# EAGLE design DriverModuleWing (EAGLE 9.6.2)
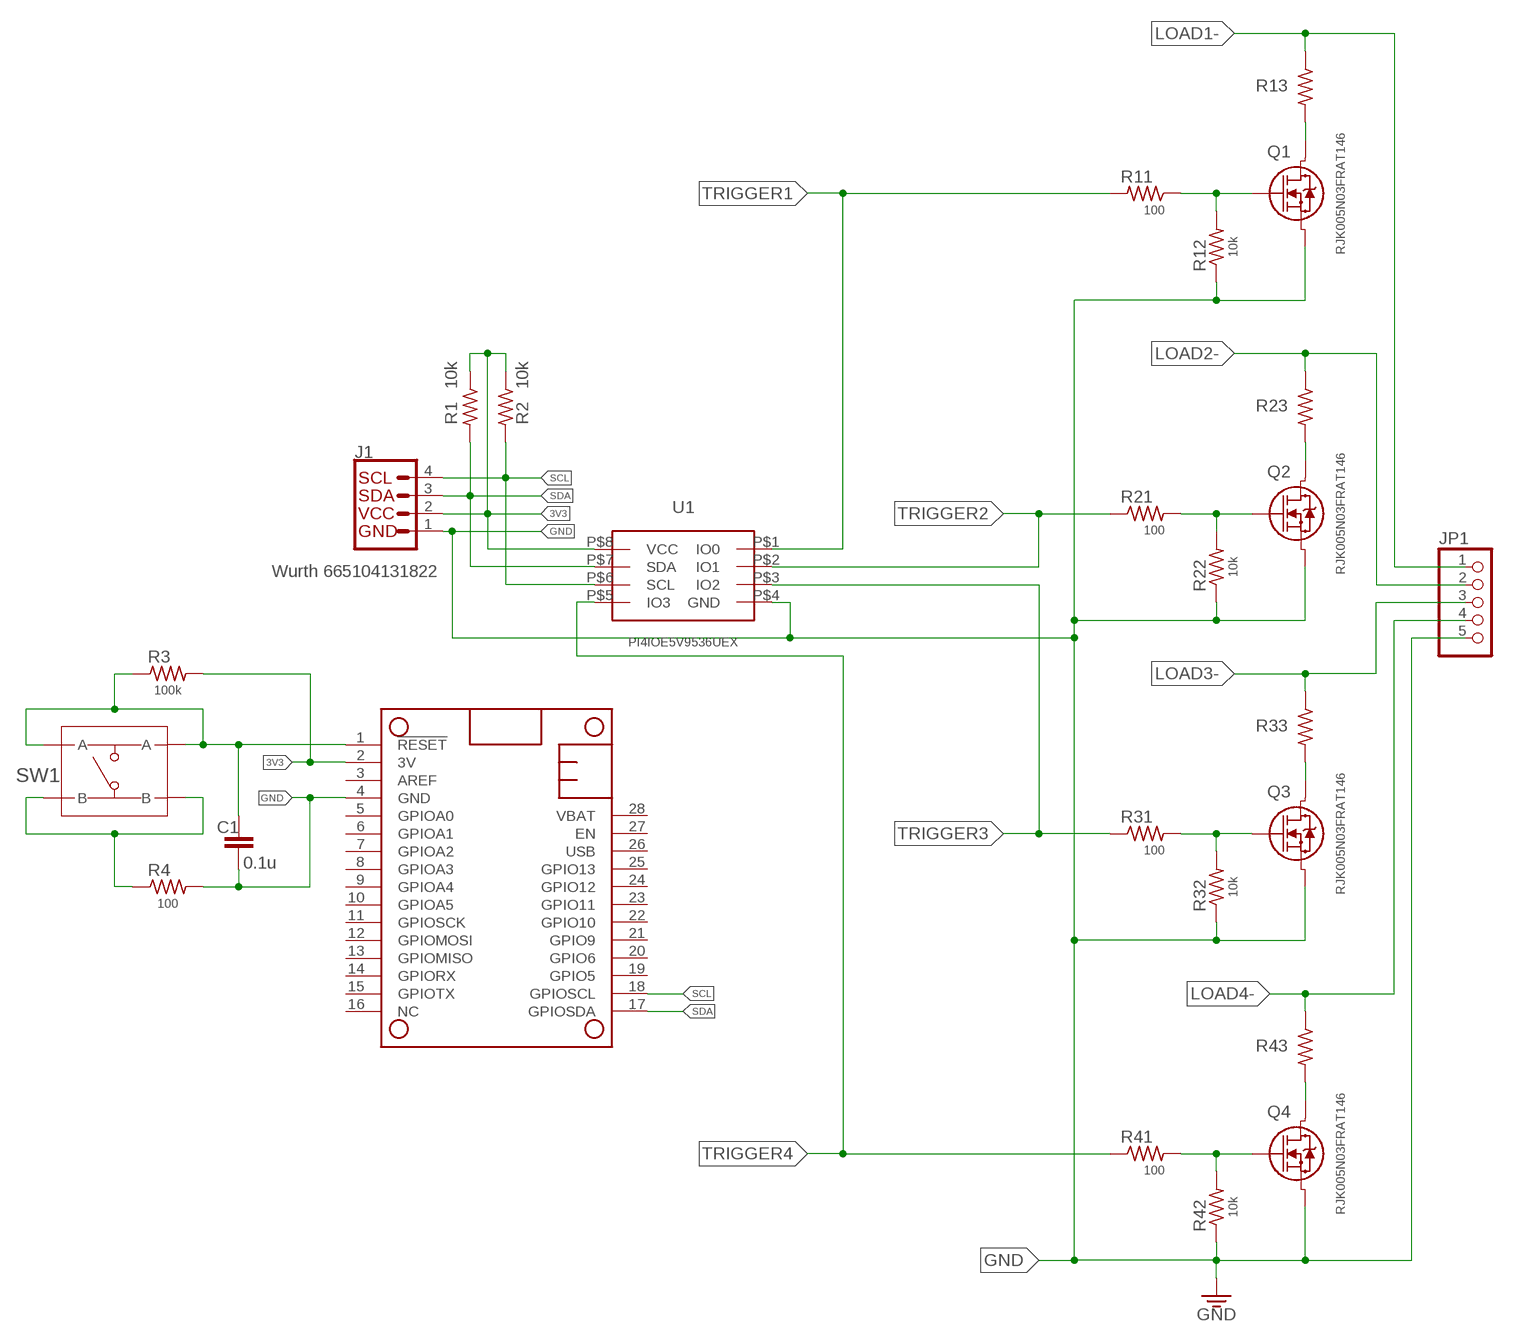
[diagram p0: schematic, sheet 1]

## Parts
C1  0.1u  C-SMD-0805  [SMD-0805]
J1  Wurth 665104131822  QWIIC_CONNECTORJS-1MM  [1X04_1MM_RA]
JP1  HEADER-1X576MIL  [1X05_ROUND_76]
MS1  FEATHERWING_NODIM  [FEATHERWING_DIM]
Q1  RJK005N03FRAT146  RJK005N03FRAT146TRANS_RHK003N_ROM-M  [TRANS_RHK003N_ROM-M]
Q2  RJK005N03FRAT146  RJK005N03FRAT146TRANS_RHK003N_ROM-M  [TRANS_RHK003N_ROM-M]
Q3  RJK005N03FRAT146  RJK005N03FRAT146TRANS_RHK003N_ROM-M  [TRANS_RHK003N_ROM-M]
Q4  RJK005N03FRAT146  RJK005N03FRAT146TRANS_RHK003N_ROM-M  [TRANS_RHK003N_ROM-M]
R1  10k  R-US_R0603  [R0603]
R2  10k  R-US_R0603  [R0603]
R3  100k  R-US_R0603  [R0603]
R4  100  R-US_R0603  [R0603]
R11  100  R-US_R0603  [R0603]
R12  10k  R-US_R0603  [R0603]
R13  R-US_R1206  [R1206]
R21  100  R-US_R0603  [R0603]
R22  10k  R-US_R0603  [R0603]
R23  R-US_R1206  [R1206]
R31  100  R-US_R0603  [R0603]
R32  10k  R-US_R0603  [R0603]
R33  R-US_R1206  [R1206]
R41  100  R-US_R0603  [R0603]
R42  10k  R-US_R0603  [R0603]
R43  R-US_R1206  [R1206]
SW1  PTS645SK43SMTR92LFS-PTS647-4.5  [SWITCH_CK_PTS647SN38SMTR2LFS]
U1  PI4IOE5V9536UEX  PI4IOE5V9536-UEX  [MSOP-8]

## Nets
3V3: J1.2(VCC) MS1.2(3V) R1.1 R2.1 R3.2 U1.P$8(VCC)
GATE1 [8mil]: Q1.2 R11.1 R12.2
GATE2 [8mil]: Q2.2 R21.2 R22.2
GATE3 [8mil]: Q3.2 R31.2 R32.2
GATE4 [8mil]: Q4.2 R41.2 R42.2
GND [8mil]: C1.P$2 J1.1(GND) JP1.5 MS1.4(GND) Q1.3 Q2.3 Q3.3 Q4.3 R4.2 R12.1 R22.1 R32.1 R42.1 U1.P$4(GND)
LD- [8mil]: Q4.1 R43.2
LD-1 [8mil]: Q3.1 R33.2
LD-2 [8mil]: Q2.1 R23.2
LD-3 [8mil]: Q1.1 R13.2
LOAD1- [8mil]: JP1.1 R13.1
LOAD2- [8mil]: JP1.2 R23.1
LOAD3- [8mil]: JP1.3 R33.1
LOAD4- [8mil]: JP1.4 R43.1
N$1: C1.P$1 MS1.1(!RESET) R3.1 SW1.1(A) SW1.2(A)
N$2: R4.1 SW1.3(B) SW1.4(B)
SCL: J1.4(SCL) MS1.18(GPIOSCL) R2.2 U1.P$6(SCL)
SDA: J1.3(SDA) MS1.17(GPIOSDA) R1.2 U1.P$7(SDA)
TRIGGER1 [8mil]: R11.2 U1.P$1(IO0)
TRIGGER2 [8mil]: R21.1 U1.P$2(IO1)
TRIGGER3 [8mil]: R31.1 U1.P$3(IO2)
TRIGGER4 [8mil]: R41.1 U1.P$5(IO3)
Unconnected: MS1.3(AREF) MS1.5(GPIOA0) MS1.6(GPIOA1) MS1.7(GPIOA2) MS1.8(GPIOA3) MS1.9(GPIOA4) MS1.10(GPIOA5) MS1.11(GPIOSCK) MS1.12(GPIOMOSI) MS1.13(GPIOMISO) MS1.14(GPIORX) MS1.15(GPIOTX) MS1.16(NC) MS1.19(GPIO5) MS1.20(GPIO6) MS1.21(GPIO9) MS1.22(GPIO10) MS1.23(GPIO11) MS1.24(GPIO12) MS1.25(GPIO13) MS1.26(USB) MS1.27(EN) MS1.28(VBAT)

## Library data of the parts
C1 = home:C-SMD: CAPACITOR naming: grid - package width
J1 = SparkFun-Connectors:QWIIC_CONNECTOR: SparkFun I2C Standard Qwiic Connector An SMD 1mm pitch JST connector makes it easy and quick (get it? Qwiic?) to connect I2C devices to each other. The Qwiic system <http://www.sparkfun.com/qwiic> enables fast and solderless connection between popular platforms and various sensors and actuators. We carry 200mm <https://www.sparkfun.com/products/14204>, 100mm <https://www.sparkfun.com/products/14205>, 50mm <https://www.sparkfun.com/products/14206>, and breadboard friendly <https://www.sparkfun.com/products/14207> Qwiic cables. We also offer 10 pcs strips <https://www.sparkfun.com/products/14323> the SMD connectors.
JP1 = microbuilder:HEADER-1X5: PIN HEADER
MS1 = adafruit:FEATHERWING
Q1-Q4 = home:RJK005N03FRAT146; COPYRIGHT: Copyright (C) 2022 Ultra Librarian. All rights reserved.; DIGI-KEY_PART_NUMBER_1: RJK005N03FRAT146CT-ND; DIGI-KEY_PART_NUMBER_2: RJK005N03FRAT146DKR-ND; DIGI-KEY_PART_NUMBER_3: RJK005N03FRAT146TR-ND; MANUFACTURER_PART_NUMBER: RJK005N03FRAT146; MFR_NAME: ROHM Semiconductor
R1-R4 R11-R13 R21-R23 R31-R33 R41-R43 = adafruit:R-US_: RESISTOR, American symbol
SW1 = home:PTS645SK43SMTR92LFS
U1 = home:PI4IOE5V9536

## Net classes
1 8mil: width 0.203 mm

## Board
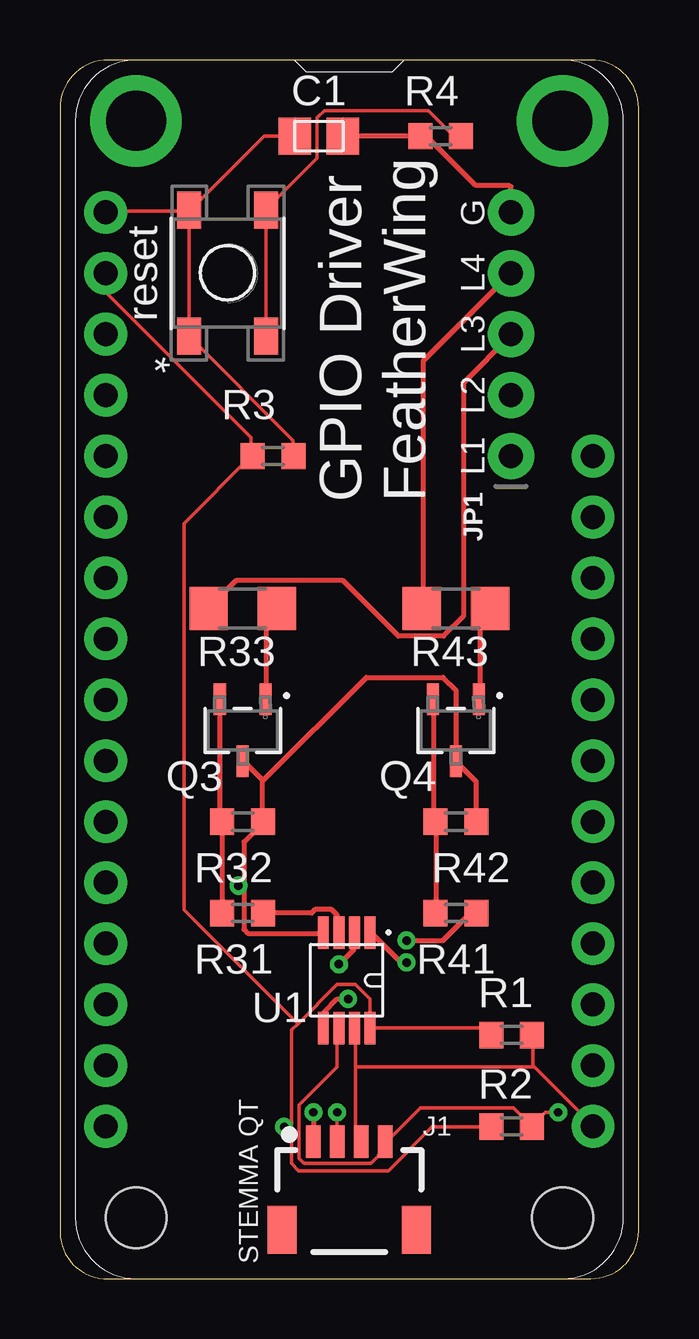
[diagram p1: board, top side]
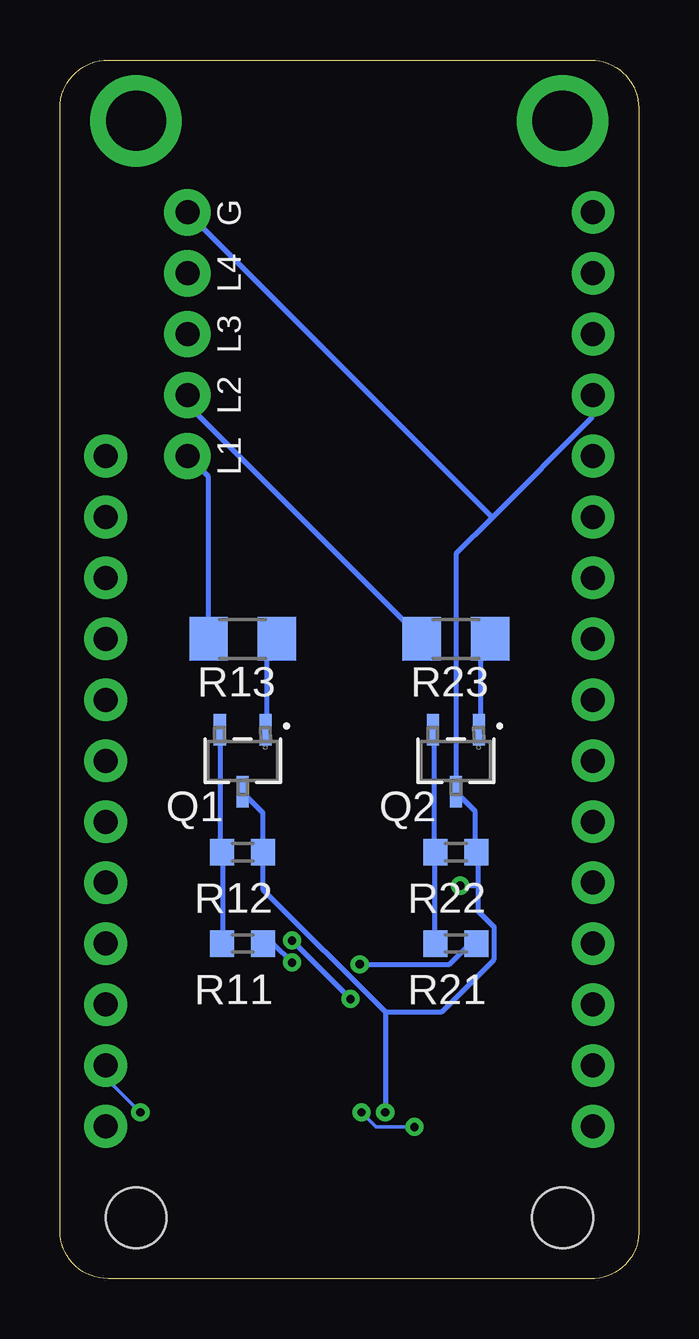
[diagram p2: board, bottom side, seen from below]

Size 24.13 x 50.8 mm. Coordinates in mm from the lower left corner, seen from the top.
Outline: 24.13,2 24.13,48.8 arc90 22.13,50.8 2,50.8 arc90 0,48.8 0,1.91 arc90 2,0 22.13,0 arc90 24.13,2
Copper layers (1*16): Top 0.035mm / dielectric 1.5mm / Bottom 0.035mm
Design rules "default": minimum track width 6mil, minimum drill 0.35mm, track to track 6mil, track to pad 6mil, pad to pad 6mil, via to via 6mil, smd to smd 6mil, copper to edge 40mil, drill to drill 6mil, minimum pad ring 10mil, minimum via ring 8mil, stop-mask expansion 4mil, vias tented up to drill 0mil, thermal gap 10mil

### Footprints (pad centres in the part's own frame; a part is rotated, then mirrored left to right if it is on the bottom)
SMD-0805 = smd 1.35 x 1.55: P$1 -1,0; P$2 1,0
1X04_1MM_RA = smd 0.6 x 1.35: 1 -1.5,0; 2 -0.5,0; 3 0.5,0; 4 1.5,0 | smd 1.2 x 2: NC1 2.8,-3.675; NC2 -2.8,-3.675
1X05_ROUND_76 = drill 1 pad 1.93: 1 -5.08,0; 2 -2.54,0; 3 0,0; 4 2.54,0; 5 5.08,0
FEATHERWING_DIM = drill 1 pad 1.778: 1 6.35,1.27; 2 8.89,1.27; 3 11.43,1.27; 4 13.97,1.27; 5 16.51,1.27; 6 19.05,1.27; 7 21.59,1.27; 8 24.13,1.27; 9 26.67,1.27; 10 29.21,1.27; 11 31.75,1.27; 12 34.29,1.27; 13 36.83,1.27; 14 39.37,1.27; 15 41.91,1.27; 16 44.45,1.27; 17 44.45,21.59; 18 41.91,21.59; 19 39.37,21.59; 20 36.83,21.59; 21 34.29,21.59; 22 31.75,21.59; 23 29.21,21.59; 24 26.67,21.59; 25 24.13,21.59; 26 21.59,21.59; 27 19.05,21.59; 28 16.51,21.59 | drill 2.5 pad 3.81: P$1 2.54,20.32; P$2 2.54,2.54 | hole 2.54: 48.26,20.32; 48.26,2.54
TRANS_RHK003N_ROM-M = smd 0.508 x 1.321: 1 -0.953,-1.295; 2 0.953,-1.295; 3 0,1.295
R0603 = smd 1 x 1.1: 1 -0.85,0; 2 0.85,0
R1206 = smd 1.6 x 1.803: 1 -1.422,0; 2 1.422,0
SWITCH_CK_PTS647SN38SMTR2LFS = smd 1.55 x 1: 1 -2.625,1.6; 2 2.625,1.6; 3 -2.625,-1.6; 4 2.625,-1.6
MSOP-8 = smd 1.35 x 0.45: P$1 -1.99,0.975; P$2 -1.99,0.325; P$3 -1.99,-0.325; P$4 -1.99,-0.975; P$5 1.99,-0.975; P$6 1.99,-0.325; P$7 1.99,0.325; P$8 1.99,0.975

### Placement (x,y rotation side)
C1  10.79,47.62 0 top
J1  12.06,5.71 0 top
JP1  18.81,39.37 90 top
MS1  0.64,50.8 270 top
Q1  16.51,21.59 180 bottom
Q2  7.62,21.59 180 bottom
Q3  7.62,22.86 180 top
Q4  16.51,22.86 180 top
R1  18.83,10.16 0 top
R2  18.83,6.35 0 top
R3  8.89,34.29 180 top
R4  15.88,47.62 180 top
R11  16.51,13.97 0 bottom
R12  16.51,17.78 180 bottom
R13  16.51,26.67 0 bottom
R21  7.62,13.97 180 bottom
R22  7.62,17.78 180 bottom
R23  7.62,26.67 0 bottom
R31  7.62,15.24 180 top
R32  7.62,19.05 180 top
R33  7.62,27.94 0 top
R41  16.51,15.24 180 top
R42  16.51,19.05 180 top
R43  16.51,27.94 0 top
SW1  6.99,41.91 90 top
U1  11.96,12.44 270 top

### Tracks (layer width: path | path; a pad name or v marks a point on that pad's centre or on a via)
3V3  (via drill 0.35)
  Top 0.152: 9.65,6.33 9.65,10.36 9.92,10.63 | 9.65,6.33 9.65,4.8 9.96,4.5 13.69,4.5 15.52,6.33 17.96,6.33 R2.1 | 9.92,10.63 11.56,12.27 12.32,12.27 12.93,11.66 12.93,10.52 U1.P$8 17.69,10.45 R1.1 | v11.56,6.93 J1.2 | 9.65,6.33 v9.35,6.33 | 7.98,34.29 7.98,35.05 1.96,41.07 1.96,41.86 MS1.2 | 7.98,34.29 R3.2 | 7.98,34.29 5.17,31.48 5.17,15.38 9.92,10.63
  Bottom 0.152: v11.56,6.93 10.95,6.33 v9.35,6.33
GATE1
  Bottom 0.203: R11.1 17.35,14.02 17.35,17.75 R12.2 17.42,17.83 17.42,22.86 Q1.2
GATE2
  Bottom 0.203: R21.2 8.51,14.02 8.51,17.75 R22.2 8.51,17.83 8.51,22.86 Q2.2
GATE3
  Top 0.203: R31.2 6.76,15.24 6.76,19.05 R32.2 6.68,19.05 6.68,24.16 Q3.2
GATE4
  Top 0.203: R41.2 15.67,15.24 15.67,19.05 R42.2 15.6,19.13 15.6,24.16 Q4.2
GND  (via drill 0.35)
  Top 0.203: R42.1 17.35,19.05 17.35,20.73 Q4.3 16.51,24.54 15.98,25.07 12.78,25.07 8.51,20.8 8.43,20.8 | 8.43,20.8 8.43,19.05 R32.1 8.43,18.97 7.67,18.21 7.67,16.38 | 8.43,20.8 7.67,21.57 Q3.3 | 7.67,16.38 7.67,14.55 7.82,14.4 10.95,14.4 U1.P$4 | C1.P$2 R4.2 15.06,47.55 15.37,47.55 17.35,45.57 18.72,45.57 18.81,45.54 JP1.5 | v10.57,6.93 J1.1 | v7.44,16.38 7.67,16.38
  Bottom 0.203: Q1.3 16.51,20.27 15.67,19.43 15.67,17.83 R12.1 15.67,17.68 15.67,16.23 10.57,11.12 | 10.57,11.12 v10.57,6.93 | 6.68,16.38 6.68,15.32 6.02,14.65 6.02,13.31 8.21,11.12 10.57,11.12 | 6.68,16.38 6.68,17.75 R22.1 6.83,17.83 6.83,19.51 Q2.3 7.6,20.34 7.6,30.25 6.11,31.74 | 6.11,31.74 1.96,35.89 1.96,36.8 MS1.4 | 6.68,16.38 v7.44,16.38 | 6.11,31.74 JP1.5
LD-
  Top 0.203: Q4.1 17.5,24.16 17.5,27.51 17.88,27.89 R43.2
LD-1
  Top 0.203: Q3.1 8.59,27.51 8.97,27.89 R33.2
LD-2
  Bottom 0.203: Q2.1 6.6,22.94 6.6,26.29 6.22,26.67 R23.2
LD-3
  Bottom 0.203: Q1.1 15.52,22.94 15.52,26.29 15.14,26.67 R13.2
LOAD1-
  Bottom 0.203: R13.1 17.96,26.67 17.96,33.45 18.8,34.29 JP1.1
LOAD2-
  Bottom 0.203: JP1.2 18.81,36.44 R23.1
LOAD3-
  Top 0.203: JP1.3 18.81,39.34 16.81,37.34 16.81,27.61 15.99,26.79 14.11,26.79 11.8,29.1 7.35,29.1 R33.1
LOAD4-
  Top 0.203: R43.1 15.14,27.96 15.14,38.25 18.8,41.91 JP1.4
N$1
  Top 0.152: 5.38,44.5 1.96,44.5 MS1.1 | C1.P$1 8.51,47.62 5.42,44.53 SW1.2 5.38,44.5 | 5.38,44.5 5.38,39.32 SW1.1 9.73,34.94 9.73,34.3 R3.1
N$2
  Top 0.152: SW1.3 8.59,39.32 8.59,44.5 SW1.4 8.59,44.58 10.72,46.71 10.72,48.39 11.02,48.69 15.37,48.69 16.43,47.62 R4.1
SCL  (via drill 0.35)
  Top 0.152: v20.78,6.93 20.24,6.93 19.71,6.4 R2.2 18.91,7.13 15.03,7.13 13.61,5.71 J1.4 13.54,5.69 13.54,5.39 12.96,4.81 10.17,4.81 9.96,5.02 9.96,7.24 11.56,8.84 11.56,10.38 U1.P$6
  Bottom 0.152: MS1.18 22.22,8.38 v20.78,6.93
SDA
  Top 0.152: 12.32,8.84 12.32,5.94 12.55,5.71 J1.3 | 12.32,8.84 12.32,10.44 U1.P$7 | 19.75,8.88 22.22,6.4 MS1.17 | 19.75,8.88 19.71,8.91 19.71,10.13 R1.2 | 12.32,8.84 19.71,8.84 19.75,8.88
TRIGGER1  (via drill 0.35)
  Top 0.203: v14.45,13.18 14.22,13.18 13.01,14.4 U1.P$1
  Bottom 0.203: v14.45,13.18 15.21,13.95 15.6,13.95 R11.2
TRIGGER2  (via drill 0.35)
  Top 0.203: v11.63,13.11 12.24,13.72 12.24,14.4 U1.P$2
  Bottom 0.203: v11.63,13.11 7.9,13.11 7.06,13.95 6.83,13.95 R21.1
TRIGGER3
  Top 0.203: R31.1 10.49,15.24 10.64,15.39 11.33,15.39 11.56,15.16 11.56,14.48 U1.P$3
TRIGGER4  (via drill 0.35)
  Top 0.203: R41.1 17.12,15.24 15.98,14.1 v14.45,14.1 | v12.01,11.66 11.56,11.66 11.02,11.12 11.02,10.52 U1.P$5
  Bottom 0.203: v12.01,11.66 v14.45,14.1

### Text on the board
tPlace: G | reset | L4 | L3 | L2 | L1 | GPIO Driver / FeatherWing | STEMMA QT
bPlace: G | L4 | L3 | L2 | L1